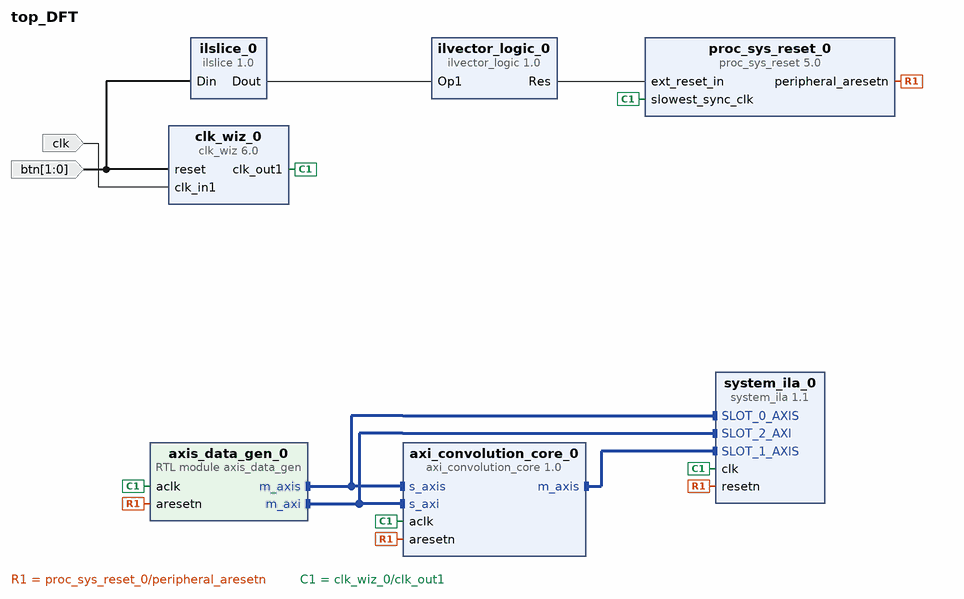
[diagram p0: block diagram of the top level]
# Vivado block design top_DFT, xc7z007sclg400-1, Vivado 2025.2
create_bd_design top_DFT

create_bd_port -dir I -from 1 -to 0 -type rst btn
set_property -dict {CONFIG.POLARITY ACTIVE_HIGH} [get_bd_ports btn]
create_bd_port -dir I -type clk clk
set_property -dict {CONFIG.FREQ_HZ 125000000} [get_bd_ports clk]

create_bd_cell -type ip -vlnv xilinx.com:user:axi_convolution_core:1.0 axi_convolution_core_0
create_bd_cell -type ip -vlnv xilinx.com:ip:proc_sys_reset:5.0 proc_sys_reset_0
create_bd_cell -type inline_hdl -vlnv xilinx.com:inline_hdl:ilslice:1.0 ilslice_0
set_property -dict {CONFIG.DIN_WIDTH 2} [get_bd_cells ilslice_0]
create_bd_cell -type inline_hdl -vlnv xilinx.com:inline_hdl:ilvector_logic:1.0 ilvector_logic_0
set_property -dict {CONFIG.C_OPERATION not CONFIG.C_SIZE 1} [get_bd_cells ilvector_logic_0]
create_bd_cell -type ip -vlnv xilinx.com:ip:clk_wiz:6.0 clk_wiz_0
set_property -dict {CONFIG.USE_LOCKED false} [get_bd_cells clk_wiz_0]
create_bd_cell -type ip -vlnv xilinx.com:ip:system_ila:1.1 system_ila_0
set_property -dict [list \
  CONFIG.C_NUM_MONITOR_SLOTS 3 \
  CONFIG.C_SLOT 2 \
  CONFIG.C_SLOT_0_INTF_TYPE xilinx.com:interface:axis_rtl:1.0 \
  CONFIG.C_SLOT_1_INTF_TYPE xilinx.com:interface:axis_rtl:1.0 \
  CONFIG.C_SLOT_2_APC_EN 0 \
  CONFIG.C_SLOT_2_INTF_TYPE xilinx.com:interface:aximm_rtl:1.0 \
] [get_bd_cells system_ila_0]
create_bd_cell -type module -reference axis_data_gen axis_data_gen_0

# ---- connections ----

connect_bd_intf_net [get_bd_intf_pins axi_convolution_core_0/s_axis] [get_bd_intf_pins axis_data_gen_0/m_axis]
connect_bd_intf_net [get_bd_intf_pins axi_convolution_core_0/s_axis] [get_bd_intf_pins system_ila_0/SLOT_0_AXIS]
connect_bd_intf_net [get_bd_intf_pins axi_convolution_core_0/m_axis] [get_bd_intf_pins system_ila_0/SLOT_1_AXIS]
connect_bd_intf_net [get_bd_intf_pins axis_data_gen_0/m_axi] [get_bd_intf_pins axi_convolution_core_0/s_axi]
connect_bd_intf_net [get_bd_intf_pins axis_data_gen_0/m_axi] [get_bd_intf_pins system_ila_0/SLOT_2_AXI]
connect_bd_net [get_bd_ports btn] [get_bd_pins ilslice_0/Din] [get_bd_pins clk_wiz_0/reset]
connect_bd_net [get_bd_ports clk] [get_bd_pins clk_wiz_0/clk_in1]
connect_bd_net [get_bd_pins ilslice_0/Dout] [get_bd_pins ilvector_logic_0/Op1]
connect_bd_net [get_bd_pins ilvector_logic_0/Res] [get_bd_pins proc_sys_reset_0/ext_reset_in]
connect_bd_net [get_bd_pins proc_sys_reset_0/peripheral_aresetn] \
  [get_bd_pins system_ila_0/resetn] [get_bd_pins axi_convolution_core_0/aresetn] [get_bd_pins axis_data_gen_0/aresetn]
connect_bd_net -net processing_system7_0_FCLK_CLK0 [get_bd_pins clk_wiz_0/clk_out1] \
  [get_bd_pins proc_sys_reset_0/slowest_sync_clk] [get_bd_pins system_ila_0/clk] [get_bd_pins axi_convolution_core_0/aclk] \
  [get_bd_pins axis_data_gen_0/aclk]

# ---- address map ----
assign_bd_address -offset 0x000 -range 256 -target_address_space [get_bd_addr_spaces axis_data_gen_0/m_axi] [get_bd_addr_segs axi_convolution_core_0/s_axi/reg0]

validate_bd_design
save_bd_design
